# EAGLE design MarioCube (EAGLE 6.1)
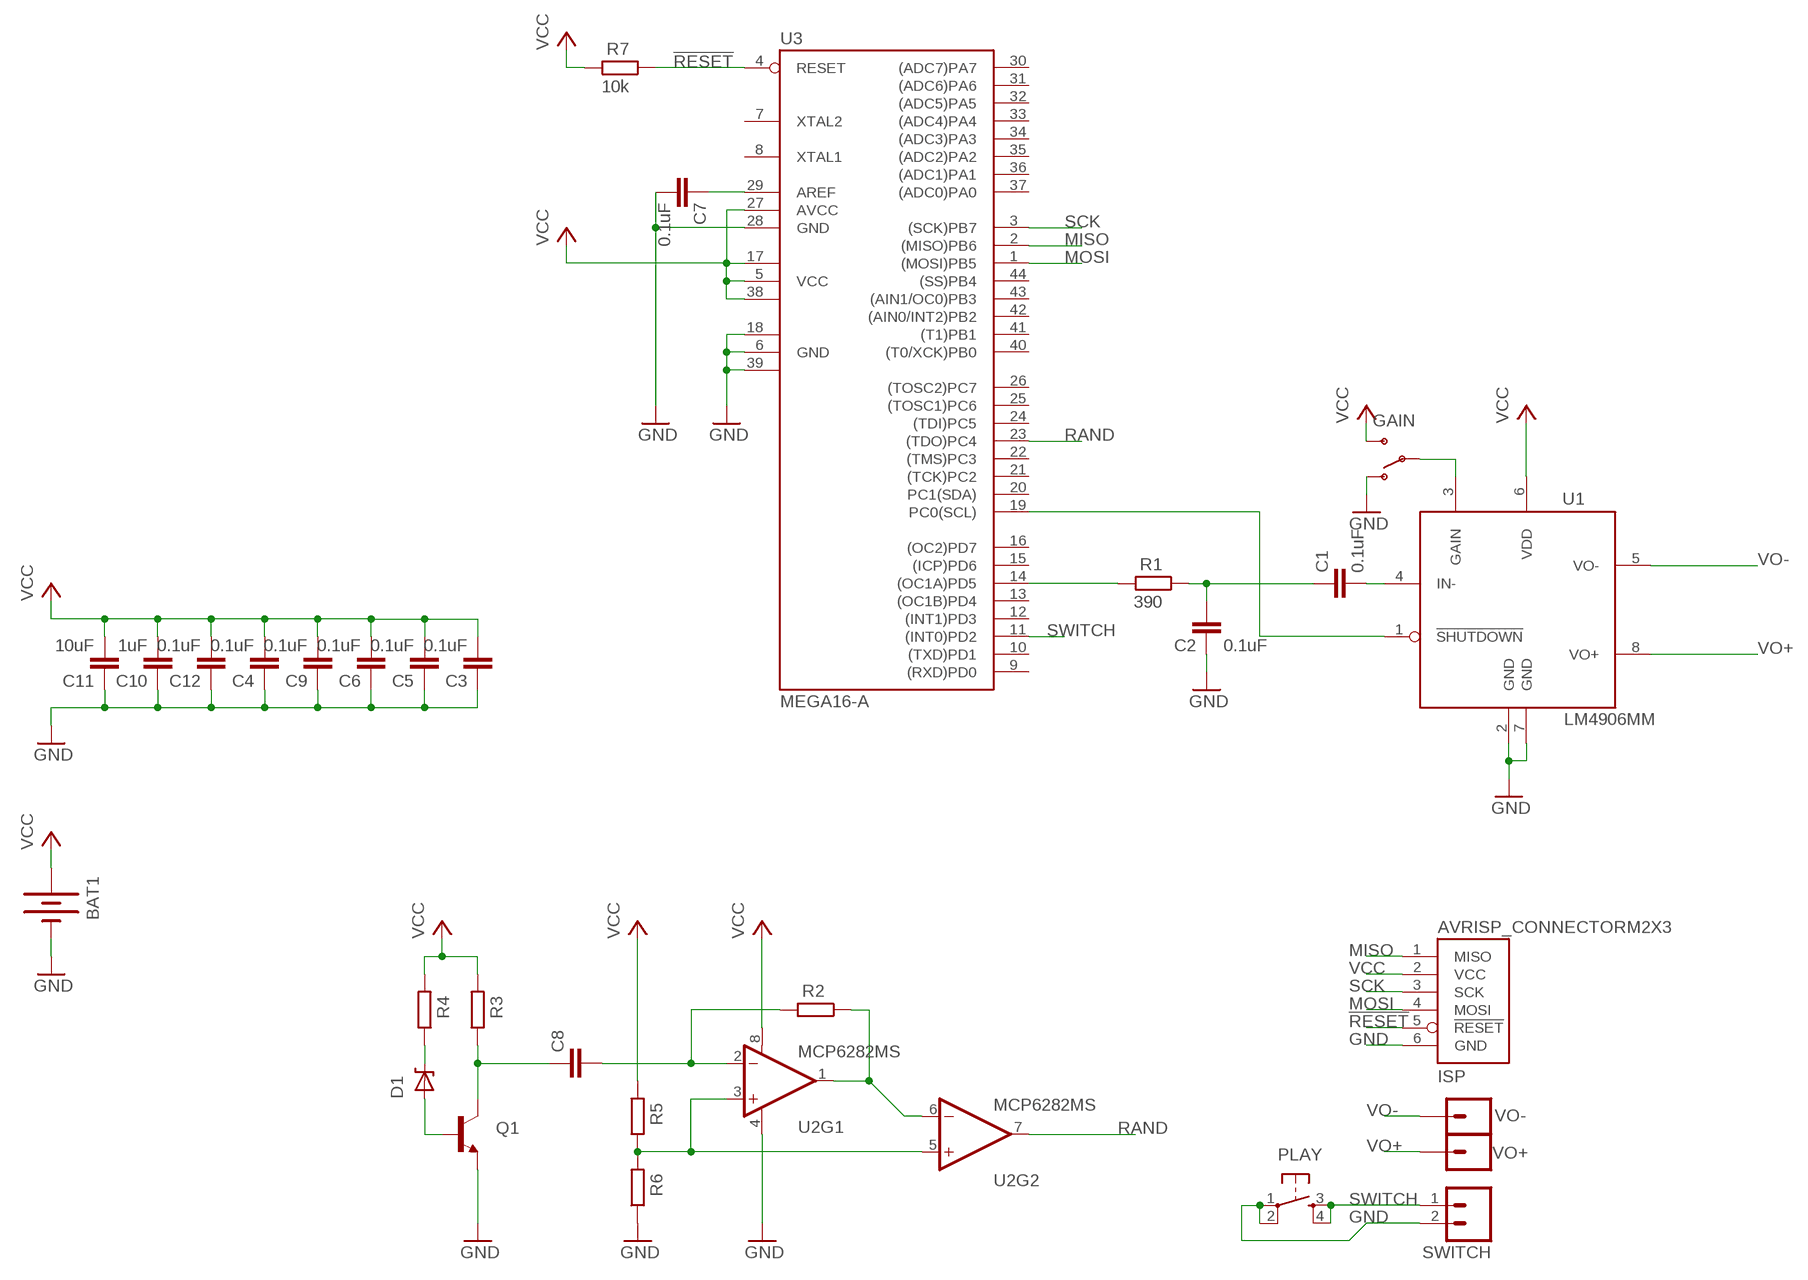
[diagram p0: schematic, sheet 1]

## Parts
BAT1  BATTERY20MM_4LEGS  [BATTCON_20MM_4LEGS]
C1  0.1uF  C-EUC0603K  [C0603K]
C2  0.1uF  C-EUC0603K  [C0603K]
C3  0.1uF  C-EUC0603K  [C0603K]
C4  0.1uF  C-EUC0603K  [C0603K]
C5  0.1uF  C-EUC0603K  [C0603K]
C6  0.1uF  C-EUC0603K  [C0603K]
C7  0.1uF  C-EUC0603K  [C0603K]
C8  C-EUC0603K  [C0603K]
C9  0.1uF  C-EUC0603K  [C0603K]
C10  1uF  C-EUC0805K  [C0805K]
C11  10uF  C-EUC0805K  [C0805K]
C12  0.1uF  C-EUC0603K  [C0603K]
D1  DIODE-ZENERSOT23  [SOT23]
GAIN  SWITCH-SPSTSMD  [AYZ0202]
ISP  AVRISP_CONNECTORM2X3  [2X3]
PLAY  TAC_SWITCHSMD  [TACTILE_SWITCH_SMD]
Q1  TRANSISTOR_NPNSOT23-3  [SOT23-3]
R1  390  R-EU_R0603  [R0603]
R2  R-EU_R0603  [R0603]
R3  R-EU_R0603  [R0603]
R4  R-EU_R0603  [R0603]
R5  R-EU_R0603  [R0603]
R6  R-EU_R0603  [R0603]
R7  10k  R-EU_R0603  [R0603]
SWITCH  M02LOCK  [1X02_LOCK]
U1  LM4906MM  [MSOP8]
U2  MCP6282MS  [MSOP8]
U3  MEGA16-A  [TQFP44]
VO+  M01OFFSET  [1X01_OFFSET]
VO-  M01OFFSET  [1X01_OFFSET]

## Nets
!RESET: ISP.5(!RESET) R7.1 U3.4(RESET)
D1: D1.2(A) Q1.1(B)
GND: BAT1.2(-) C2.1 C3.1 C4.1 C5.1 C6.1 C7.2 C9.1 C10.1 C11.1 C12.1 GAIN.1(O) ISP.6(GND) PLAY.1 PLAY.2 Q1.2(E) R6.1 SWITCH.2 U1.2(GND) U1.7(GND) U2.4(V-) U3.6(GND) U3.18(GND1) U3.28(GND) U3.39(GND2)
MISO: ISP.1(MISO) U3.2((MISO)PB6)
MOSI: ISP.4(MOSI) U3.1((MOSI)PB5)
N$1: C1.2 U1.4(IN-)
N$2: U1.1(!SHUTDOWN) U3.19(PC0(SCL))
N$3: C1.1 C2.2 R1.1
N$4: GAIN.2(P) U1.3(GAIN)
N$5: R1.2 U3.14((OC1A)PD5)
N$8: C7.1 U3.29(AREF)
N$9: D1.3(C) R4.1
N$11: C8.1 Q1.3(C) R3.1
N$17: C8.2 R2.2 U2.2(-IN)
N$18: R2.1 U2.1(OUT) U2.6(-IN)
N$19: R5.1 R6.2 U2.3(+IN) U2.5(+IN)
RAND: U2.7(OUT) U3.23((TDO)PC4)
SCK: ISP.3(SCK) U3.3((SCK)PB7)
SWITCH: PLAY.3 PLAY.4 SWITCH.1 U3.11((INT0)PD2)
VCC: BAT1.1(+) C3.2 C4.2 C5.2 C6.2 C9.2 C10.2 C11.2 C12.2 GAIN.3(S) ISP.2(VCC) R3.2 R4.2 R5.2 R7.2 U1.6(VDD) U2.8(V+) U3.5(VCC) U3.17(VCC1) U3.27(AVCC) U3.38(VCC2)
VO+: U1.8(VO+) VO+.1
VO-: U1.5(VO-) VO-.1
Unconnected: U3.7(XTAL2) U3.8(XTAL1) U3.9((RXD)PD0) U3.10((TXD)PD1) U3.12((INT1)PD3) U3.13((OC1B)PD4) U3.15((ICP)PD6) U3.16((OC2)PD7) U3.20(PC1(SDA)) U3.21((TCK)PC2) U3.22((TMS)PC3) U3.24((TDI)PC5) U3.25((TOSC1)PC6) U3.26((TOSC2)PC7) U3.30((ADC7)PA7) U3.31((ADC6)PA6) U3.32((ADC5)PA5) U3.33((ADC4)PA4) U3.34((ADC3)PA3) U3.35((ADC2)PA2) U3.36((ADC1)PA1) U3.37((ADC0)PA0) U3.40((T0/XCK)PB0) U3.41((T1)PB1) U3.42((AIN0/INT2)PB2) U3.43((AIN1/OC0)PB3) U3.44((SS)PB4)

## Library data of the parts
BAT1 = SparkFun:BATTERY: Battery Holders Various common sizes : AA, AAA, 20mm coin cell and 12mm coin cell.; DIGIKEY: BK-912-CT-ND
C1-C12 = rcl:C-EU: CAPACITOR, European symbol
D1 = V2_:DIODE-ZENER: Zener Diode Production Part - 8199 3.4V Zener Voltage
GAIN = SparkFun:SWITCH-SPST: SPST Switch Simple slide switch. Spark Fun Electronics SKU : COM-00102; DIGIKEY: 401-2013-1-ND
ISP = V2_:AVRISP_CONNECTOR
PLAY = SparkFun:TAC_SWITCH: Momentary Switch Button commonly used for reset or general input. Spark Fun Electronics SKU : COM-00097; DIGIKEY: CKN9104CT-ND
Q1 = V2_:TRANSISTOR_NPN: Transistor NPN BJT configuration in SOT23 package. MMBT2222 is the common NPN we use. Double check BCE configuration again layout.
R1-R7 = rcl:R-EU_: RESISTOR, European symbol
SWITCH = SparkFun:M02: Header 2 Standard 2-pin 0.1" header. Use with straight break away headers (SKU : PRT-00116), right angle break away headers (PRT-00553), swiss pins (PRT-00743), machine pins (PRT-00117), and female headers (PRT-00115). Molex polarized connector foot print use with SKU : PRT-08233 with associated crimp pins and housings.
U1 = V2_:LM4906: LM4906 Boomer 1W, Bypass-Capacitor-less Audio Amplifier with Internal Selectable Gain
U2 = V2_:MCP6282
U3 = atmel:MEGA16: MICROCONTROLLER 16 Kbytes FLASH 1 kbytes SRAM 512 bytes EEPROM USART 8-channel 10 bit ADC Source: avr.lbr; MPN: ATMEGA16-16AU; OC_FARNELL: 9171134; OC_NEWARK: 96K6515
VO+ VO- = SparkFun:M01: Header 1 Standard 1-pin 0.1" header. Use with straight break away headers (SKU : PRT-00116), right angle break away headers (PRT-00553), swiss pins (PRT-00743), machine pins (PRT-00117), and female headers (PRT-00115).

## Board
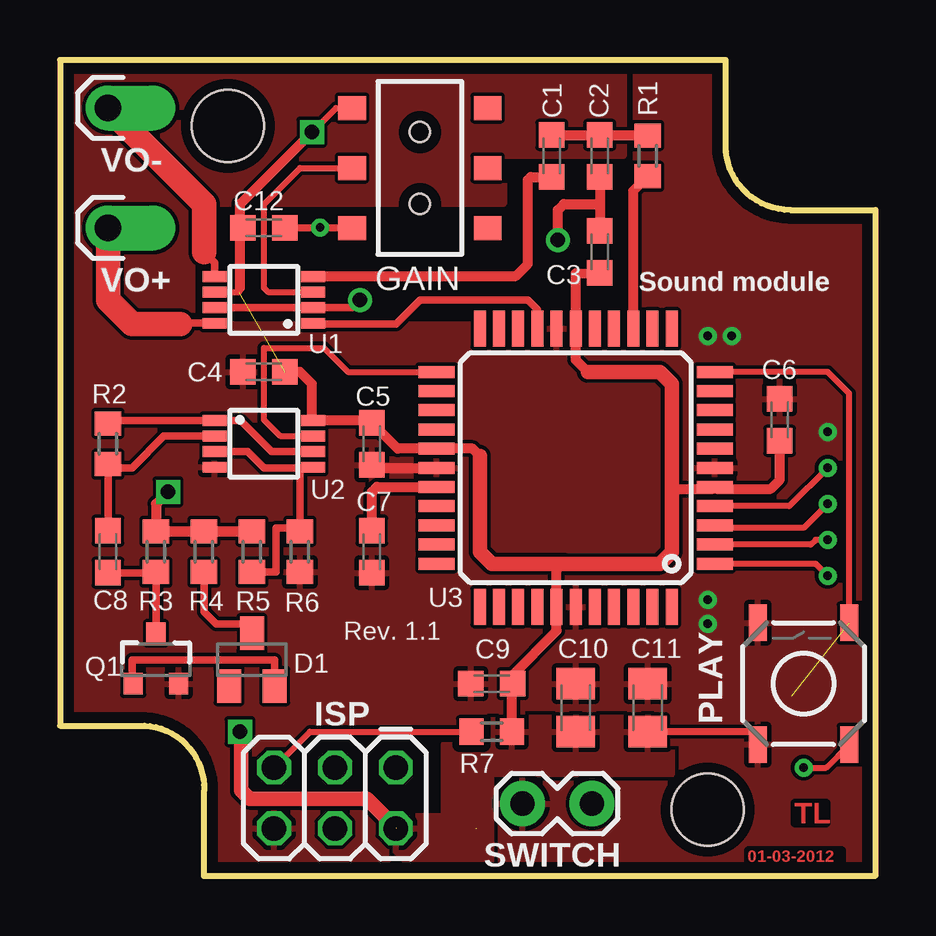
[diagram p1: board, top side]
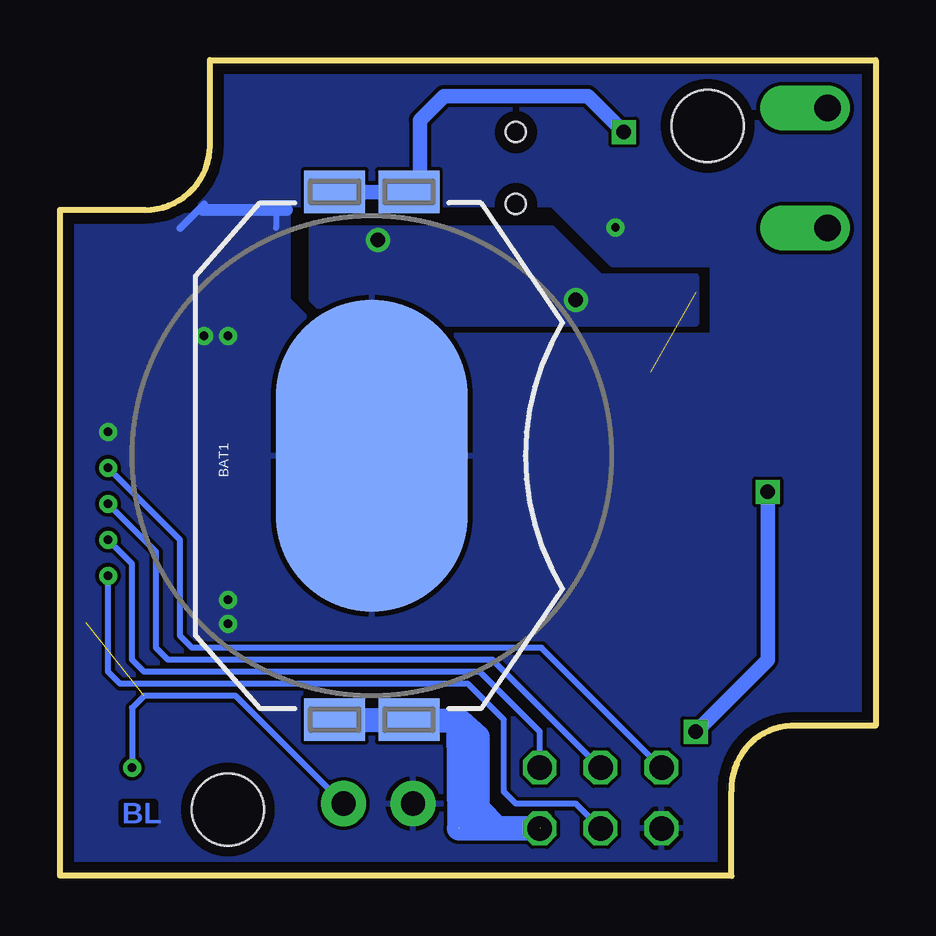
[diagram p2: board, bottom side, seen from below]

Size 34 x 34.02 mm. Coordinates in mm from the lower left corner, seen from the top.
Outline: 6,0 34,0.02 34,27.77 30.45,27.77 arc-90 27.75,30.44 27.75,34.02 0,34.02 0,6.27 3.52,6.27 arc-90 6,3.54 6,0
Copper layers (1*16): Top 0.018mm / dielectric 1.55mm / Bottom 0.018mm
Design rules: minimum track width 0.15mm, minimum drill 0.25mm, track to track 0.15mm, track to pad 0.15mm, pad to pad 0.15mm, via to via 0.15mm, smd to smd 0.15mm, copper to edge 0.45mm, drill to drill 0.3mm, minimum pad ring 0.2mm, minimum via ring 0.2mm, stop-mask expansion 0.1mm, vias tented up to drill 0mil, thermal gap 0.2mm
Holes 3 mm at 7,31.27 27,2.77

### Footprints (pad centres in the part's own frame; a part is rotated, then mirrored left to right if it is on the bottom)
BATTCON_20MM_4LEGS = smd 1.778 x 2.54: 1 -11,1.55; 3 11,1.55; P$1 -11,-1.55; P$2 11,-1.55 | smd 13 x 8: 2 0,0
C0603K = smd 1.05 x 1.08: 1 -0.875,0; 2 0.875,0
C0805K = smd 1.3 x 1.6: 1 -1,0; 2 1,0
SOT23 = smd 1 x 1.4: 1 -0.95,-1.1; 2 0.95,-1.1; 3 0,1.1
AYZ0202 = smd 1 x 1.15: 1 -2.5,2.825; 2 0,2.825; 3 2.5,2.825; 4 -2.5,-2.825; 5 0,-2.825; 6 2.5,-2.825 | hole 0.85: 1.5,0; -1.5,0
2X3 = drill 1.016 octagon: 1 0,0; 2 0,2.54; 3 2.54,0; 4 2.54,2.54; 5 5.08,0; 6 5.08,2.54
TACTILE_SWITCH_SMD = smd 1.524 x 0.762: 1 -2.54,1.905; 2 2.54,1.905; 3 -2.54,-1.905; 4 2.54,-1.905
SOT23-3 = smd 0.8 x 0.9: 1 -0.95,-1; 2 0.95,-1; 3 0,1.1
R0603 = smd 1 x 1.1: 1 -0.85,0; 2 0.85,0
1X02_LOCK = drill 1.016 pad 1.88: 1 -0.178,0; 2 2.718,0
MSOP8 = smd 0.45 x 1: 1 -0.975,-2.05; 2 -0.325,-2.05; 3 0.325,-2.05; 4 0.975,-2.05; 5 0.975,2.05; 6 0.325,2.05; 7 -0.325,2.05; 8 -0.975,2.05
TQFP44 = smd 1.5 x 0.5: 1 -5.8,4; 2 -5.8,3.2; 3 -5.8,2.4; 4 -5.8,1.6; 5 -5.8,0.8; 6 -5.8,0; 7 -5.8,-0.8; 8 -5.8,-1.6; 9 -5.8,-2.4; 10 -5.8,-3.2; 11 -5.8,-4; 23 5.8,-4; 24 5.8,-3.2; 25 5.8,-2.4; 26 5.8,-1.6; 27 5.8,-0.8; 28 5.8,0; 29 5.8,0.8; 30 5.8,1.6; 31 5.8,2.4; 32 5.8,3.2; 33 5.8,4 | smd 0.5 x 1.5: 12 -4,-5.8; 13 -3.2,-5.8; 14 -2.4,-5.8; 15 -1.6,-5.8; 16 -0.8,-5.8; 17 0,-5.8; 18 0.8,-5.8; 19 1.6,-5.8; 20 2.4,-5.8; 21 3.2,-5.8; 22 4,-5.8; 34 4,5.8; 35 3.2,5.8; 36 2.4,5.8; 37 1.6,5.8; 38 0.8,5.8; 39 0,5.8; 40 -0.8,5.8; 41 -1.6,5.8; 42 -2.4,5.8; 43 -3.2,5.8; 44 -4,5.8
1X01_OFFSET = drill 1.118 pad 1.88 offset: 1 0,0

### Placement (x,y rotation side)
BAT1  21,17.52 90 bottom
C1  20.5,30.02 270 top
C2  22.5,30.02 90 top
C3  22.5,26.02 270 top
C4  8.5,21.02 0 top
C5  13,18.02 90 top
C6  30,19.02 270 top
C7  13,13.52 270 top
C8  2,13.52 90 top
C9  18,8.02 0 top
C10  21.5,7.02 270 top
C11  24.5,7.02 270 top
C12  8.5,27.02 180 top
D1  8,9.02 0 top
GAIN  15,29.52 90 top
ISP  14,4.52 180 top
PLAY  31,8.02 90 top
Q1  4,9.02 0 top
R1  24.5,30.02 270 top
R2  2,18.02 270 top
R3  4,13.52 90 top
R4  6,13.52 90 top
R5  8,13.52 90 top
R6  10,13.52 90 top
R7  18,6.02 0 top
SWITCH  22,3.02 180 top
U1  8.5,24.02 90 top
U2  8.5,18.02 270 top
U3  21.5,17.02 180 top
VO+  2,27.02 270 top
VO-  2,32.02 270 top

### Tracks (layer width: path | path; a pad name or v marks a point on that pad's centre or on a via)
!RESET  (via drill 0.35)
  Top 0.254: 9,4.52 ISP.5 10.42,6.02 R7.1 | U3.4 30.4,15.42 v32,17.02
  Bottom 0.254: v32,17.02 29,14.02 29,10.02 28.5,9.52 13.92,9.52 ISP.5
D1
  Top 0.305: Q1.1 3,8.02 3,9.02 8.95,9.02 D1.2
GND  (via drill 0.35, 0.6)
  Top 0.305: C12.1 v10.84,27.03 GAIN.1 | U1.7 U1.2 12.18,23.69 v12.5,24.02
  Top 0.406: U3.28 13.12,17.02 C5.1 | C2.1 22.5,28.02 | 22.5,28.02 C3.1 | v20.75,26.52 20.75,27.77 21,28.02 22.5,28.02
  Bottom 0.254: 24.55,27.77 25,27.77 25,27.02
  Bottom 0.305: 28,28.02 29,27.02
  Bottom 0.508: 24.55,27.77 28.05,27.77
  Bottom 1.27: BAT1.2 20,20.52 20,21.02
  other vias: 32,18.52 27,11.52 27,10.52 27,22.52 28,22.52
  pour Bottom: 7.5,23.02 22.5,23.02 23.5,24.02 23.5,27.02 13.5,27.02 11.5,25.02 7.5,25.02
  pour Top (rank 2): 5.5,23.02 24,23.02 24,34.52 28,35.52 36.5,32.52 36.5,-0.48 3,-0.48 -1,3.52 -1,17.52 -0.5,34.52 23.5,34.52 23.5,30.02 18.5,30.02 18.5,28.02 5.5,28.02
  pour Bottom: -0.5,34.52 29.5,34.52 30,34.02 30,32.52 34.5,28.02 13.5,28.02 11,25.52 6.8,25.52 6.8,22.52 23,22.52 24.5,24.02 24.5,27.52 34.5,27.52 35,27.02 35,0.02 6,0.02 -0.5,6.02
MISO  (via drill 0.35)
  Top 0.254: v32,14.02 31.5,14.02 31.3,13.82 U3.2
  Bottom 0.254: v32,14.02 31,13.02 31,9.02 30.5,8.52 16.5,8.52 14,6.02 ISP.1
MOSI  (via drill 0.35)
  Top 0.254: U3.1 31.5,13.02 v32,12.52
  Bottom 0.254: v32,12.52 32,8.52 31.5,8.02 17,8.02 15.5,6.52 15.5,3.52 15,3.02 12.5,3.02 ISP.4
N$1
  Top 0.305: U1.4 10.57,25.02
  Top 0.406: C1.2 19.62,29.14 19.5,29.02 19.5,25.52 19,25.02 10.57,25.02
N$2
  Top 0.305: U3.19 19.9,23.62 19.5,24.02 15,24.02 14,23.02 10.57,23.02 U1.1
N$3
  Top 0.305: 24.48,30.89 R1.1
  Top 0.406: C1.1 C2.2 24.48,30.89
N$4
  Top 0.254: GAIN.2 10,29.52 8.5,28.02 8.5,24.52 8.68,24.34 U1.3
N$5
  Top 0.406: U3.14 23.9,28.57 R1.2
N$6
  Bottom 1.016: 17.32,6.44 16.59,5.8 16.59,2.22
N$7
  Bottom 0.61: 19.5,28.52 23,28.52
N$8
  Top 0.406: U3.29 13.2,16.22 13,16.02 C7.1
N$9
  Top 0.305: R4.1 6,11.02 6.5,10.52 7.6,10.52 D1.3
N$10
  Bottom 1.016: 15.8,2.02 16.5,2.72
N$11
  Top 0.305: C8.1 3.98,12.64 R3.1 Q1.3
N$17
  Top 0.305: U2.2 4.33,18.34 3,17.02 2.15,17.02 R2.2 C8.2
N$18
  Top 0.305: U2.6 8.82,17.69 7.53,18.99 U2.1 2.12,18.99 R2.1
N$19
  Top 0.305: U2.3 7.83,17.69 8.5,17.02 10,17.02 | U2.5 10.53,17.02 10,17.02 | R5.1 9,12.67 9,14.52 10,14.52 R6.2 10,17.02
RAND
  Top 0.254: U3.23 12,21.02 11,22.02 8.5,22.02 8.5,19.02 9.18,18.34 U2.7
SCK  (via drill 0.35)
  Top 0.254: v32,15.52 31,14.52 27.4,14.52 U3.3
  Bottom 0.254: v32,15.52 30,13.52 30,9.52 29.5,9.02 15.96,9.02 ISP.3
SWITCH  (via drill 0.35)  (1 unrouted)
  Top 0.254: U3.11 32,21.02 32.91,20.11 PLAY.4 | v31,4.52 31.95,4.52 PLAY.3
  Bottom 0.254: SWITCH.1 26.68,7.52 30.5,7.52 31,7.02 v31,4.52
VCC  (via drill 0.6)  (3 unrouted)
  Top 0.254: GAIN.3 11.5,32.02 v10.5,31.02 | 7.5,27.14 C12.2 7.5,26.89 | U1.6 7.47,24.34 7.5,24.52
  Top 0.305: 27.38,16.14 U3.5 27.23,16.14 | C11.2 29.14,6.03 | 25.5,16.02 25.62,16.14 | 20.7,12.72 21,13.02 | U2.8 10.5,19.04
  Top 0.406: C3.2 21.5,25.12 U3.17 21.5,21.52 22,21.02 | v10.5,31.02 7.5,28.02 7.5,27.14 | 7.5,24.52 7.5,26.89 | R3.2 R4.2 R5.2 4.15,14.37 4,14.52 4,15.52 v4.5,16.02 | 25.62,16.14 27.23,16.14 | 27.38,16.14 29.62,16.14 30,16.52 C6.2 | 17.5,17.52 17.2,17.82 U3.27 14.07,17.82 C5.2 12.9,18.99 U2.8 | 20.7,12.72 U3.38 20.7,10.22 18.88,8.39 C9.2 18.85,7.99 R7.2 | C4.2 10,21.02 10.5,20.52 10.5,19.04
  Top 0.61: 22,21.02 25,21.02 25.5,20.52 25.5,16.02 25.5,13.52 25,13.02 21,13.02 18,13.02 17.5,13.52 17.5,17.52 | 14,2.02 12.8,3.22 7.9,3.22 7.55,3.57 7.55,5.47 v7.5,6.02
  Bottom 0.61: 19,28.52 19,31.52 18,32.52 12,32.52 v10.5,31.02 | v4.5,16.02 4.5,9.02 v7.5,6.02
  Bottom 1.016: ISP.2 17.36,1.98 | BAT1.1 17.38,6.45 17.35,1.98
  pour Top (isolate 0.305): 13.5,2.52 16,2.52 16,5.5 18.08,5.42 18.1,6.61 25.46,6.61 25.5,5.52 25.5,4.21 17.97,4.23 17.97,0.52 14.5,0.52 13.5,1.52
VO+
  Top 0.305: 6.42,23.02 U1.8 5.03,23.04 5,23.02
  Top 1.016: VO+.1 2,24.02 3,23.02 5,23.02
VO-
  Top 0.305: U1.5 6.45,25.57 6,26.02
  Top 1.016: 6,26.02 6,28.02 VO-.1

### Text on the board
Top: TL | 01-03-2012
Bottom: BL
Document: Hammond 1551PTBU
_tsilk: Sound module | Rev. 1.1